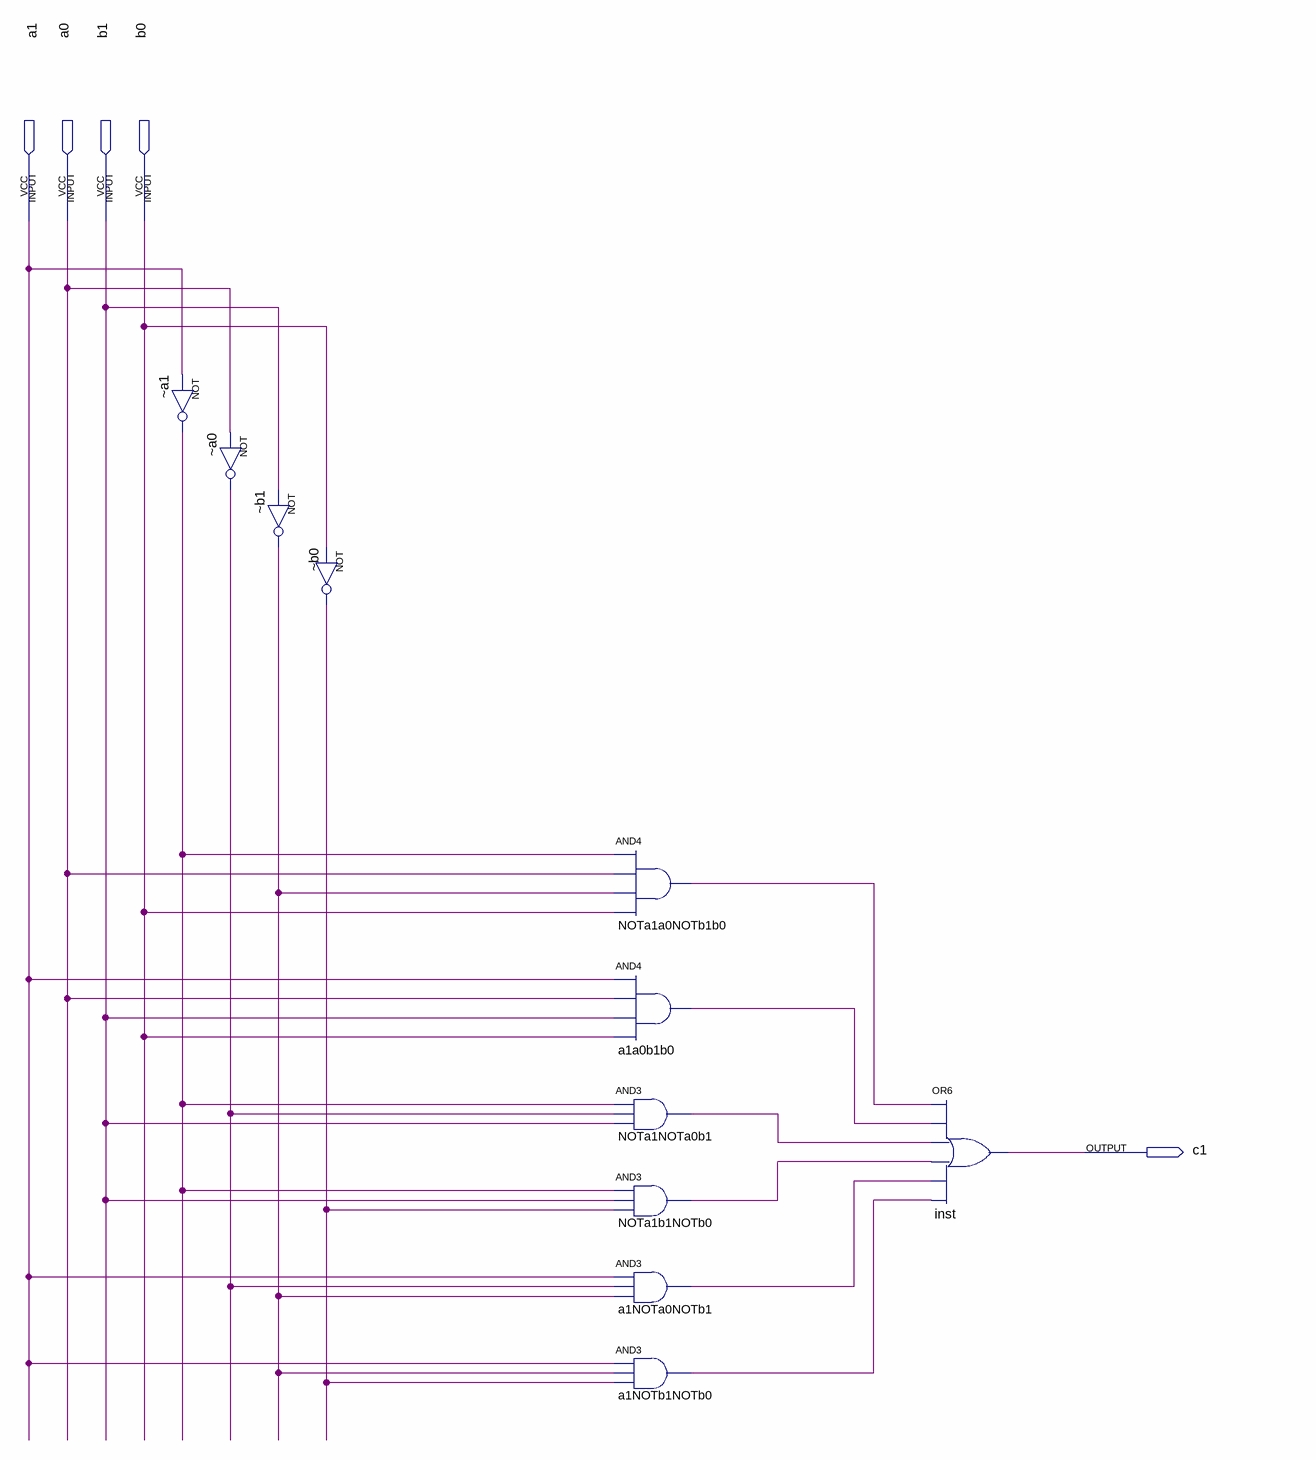
[diagram p0: schematic sheet]
// Quartus schematic c1Block.bdf as structural Verilog: 11 symbols, 5 pins
module c1Block (
  input  a1,
  input  a0,
  input  b1,
  input  b0,
  output c1
);

  wire _a0_out, _a1_out, _b0_out, _b1_out, a1a0b1b0_out, a1NOTa0NOTb1_out, a1NOTb1NOTb0_out,
       NOTa1a0NOTb1b0_out, NOTa1b1NOTb0_out, NOTa1NOTa0b1_out;

  not \u_~a1  (_a1_out, a1);
  not \u_~a0  (_a0_out, a0);
  not \u_~b1  (_b1_out, b1);
  not \u_~b0  (_b0_out, b0);
  and NOTa1a0NOTb1b0 (NOTa1a0NOTb1b0_out, _a1_out, a0, _b1_out, b0);
  and a1a0b1b0 (a1a0b1b0_out, a1, a0, b1, b0);
  and NOTa1NOTa0b1 (NOTa1NOTa0b1_out, _a1_out, _a0_out, b1);
  and NOTa1b1NOTb0 (NOTa1b1NOTb0_out, _a1_out, b1, _b0_out);
  and a1NOTa0NOTb1 (a1NOTa0NOTb1_out, a1, _a0_out, _b1_out);
  and a1NOTb1NOTb0 (a1NOTb1NOTb0_out, a1, _b1_out, _b0_out);
  or inst (c1, NOTa1a0NOTb1b0_out, a1a0b1b0_out, NOTa1NOTa0b1_out, NOTa1b1NOTb0_out, a1NOTa0NOTb1_out, a1NOTb1NOTb0_out);
endmodule
